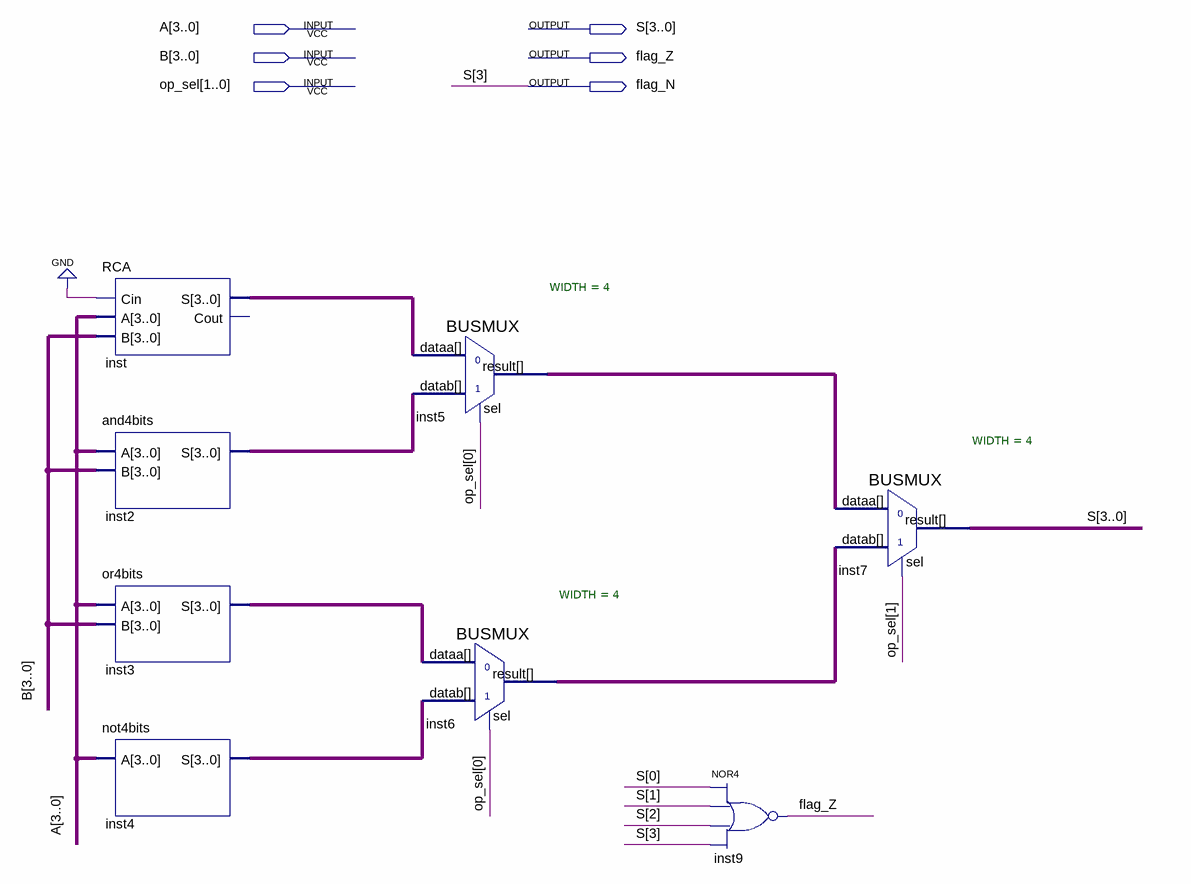
[diagram p0: schematic sheet]
// Quartus schematic ULA.bdf as structural Verilog: 8 symbols, 6 pins
module ULA (
  input  [3:0] A,
  input  [3:0] B,
  input  [1:0] op_sel,
  output [3:0] S,
  output flag_Z,
  output flag_N
);

  wire [3:0] inst2_s, inst3_s, inst4_s, inst5_result, inst6_result, inst_s;

  RCA inst (.Cin(1'b0), .A(A), .B(B), .S(inst_s));  // open: Cout
  and4bits inst2 (.A(A), .B(B), .S(inst2_s));
  or4bits inst3 (.A(A), .B(B), .S(inst3_s));
  not4bits inst4 (.A(A), .S(inst4_s));
  BUSMUX #(.WIDTH(4)) inst5 (.datab(inst2_s), .sel(op_sel[0]), .dataa(inst_s), .result(inst5_result));
  BUSMUX #(.WIDTH(4)) inst6 (.datab(inst4_s), .sel(op_sel[0]), .dataa(inst3_s), .result(inst6_result));
  nor inst9 (flag_Z, S[0], S[1], S[2], flag_N);
  BUSMUX #(.WIDTH(4)) inst7 (.datab(inst6_result), .sel(op_sel[1]), .dataa(inst5_result), .result({flag_N, S[2:0]}));

  assign S[3] = flag_N;
endmodule
